# Altium project TS_24 UCM R2.PrjPcb
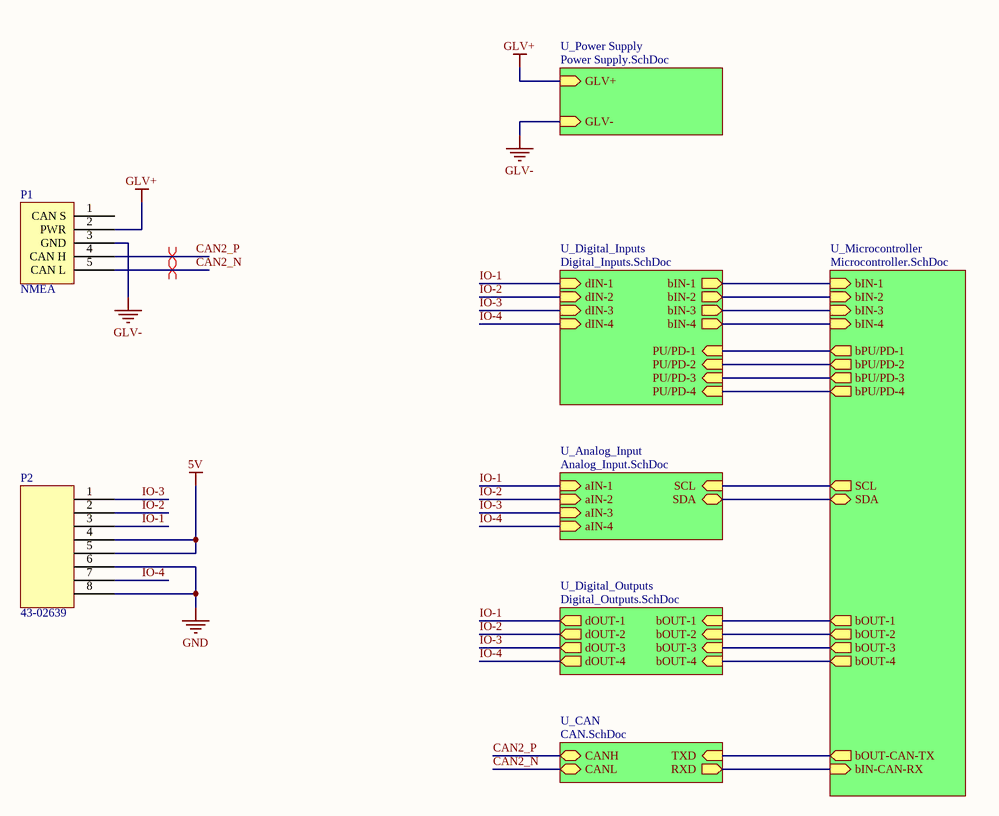
[diagram p0: Top Level.SchDoc]
7 sheets, 91 parts. Net scope: hierarchical (ports join the sheet entries above them; power ports are global).
Board file: TS_24 UCM R1.PcbDoc
Sheets:
  Top Level.SchDoc
    U_Analog_Input = Analog_Input.SchDoc
    U_Digital_Outputs = Digital_Outputs.SchDoc
    U_CAN = CAN.SchDoc
    U_Microcontroller = Microcontroller.SchDoc
    U_Power Supply = Power Supply.SchDoc
    U_Digital_Inputs = Digital_Inputs.SchDoc

## Sheet Top Level.SchDoc
size A4

### Parts
P1  NMEA  [43-01203]
P2  43-02639  [43-02639]

### Sub-sheets
U_Analog_Input = Analog_Input.SchDoc: SCL (in), SDA (bidir), aIN-1 (in), aIN-2 (in), aIN-3 (in), aIN-4 (in)
U_CAN = CAN.SchDoc: TXD (in), RXD (out), CANH (bidir), CANL (bidir)
U_Digital_Inputs = Digital_Inputs.SchDoc: dIN-1 (in), dIN-2 (in), dIN-3 (in), dIN-4 (in), bIN-4 (out), bIN-2 (out), bIN-1 (out), bIN-3 (out), PU/PD-1 (in), PU/PD-2 (in), PU/PD-3 (in), PU/PD-4 (in)
U_Digital_Outputs = Digital_Outputs.SchDoc: bOUT-1 (in), bOUT-2 (in), bOUT-3 (in), bOUT-4 (in), dOUT-1 (out), dOUT-2 (out), dOUT-3 (out), dOUT-4 (out)
U_Microcontroller = Microcontroller.SchDoc: bOUT-CAN-TX (out), bIN-CAN-RX (in), SCL (out), SDA (bidir), bOUT-1 (out), bOUT-2 (out), bOUT-3 (out), bOUT-4 (out), bIN-1 (in), bIN-2 (in), bIN-3 (in), bIN-4 (in), bPU/PD-1 (out), bPU/PD-2 (out), bPU/PD-3 (out), bPU/PD-4 (out)
U_Power Supply = Power Supply.SchDoc: GLV+ (in), GLV- (in)

### Nets
5V: P2.4 P2.5
GLV+: P1.2(PWR) ; sheet U_Power Supply/GLV+
GLV-: P1.3(GND) ; sheet U_Power Supply/GLV-
GND: P2.6 P2.8
CAN2_N: P1.5(CAN_L) ; sheet U_CAN/CANL
CAN2_P: P1.4(CAN_H) ; sheet U_CAN/CANH
IO-1: P2.3 ; sheet U_Analog_Input/aIN-1, sheet U_Digital_Outputs/dOUT-1, sheet U_Digital_Inputs/dIN-1
IO-2: P2.2 ; sheet U_Analog_Input/aIN-2, sheet U_Digital_Outputs/dOUT-2, sheet U_Digital_Inputs/dIN-2
IO-3: P2.1 ; sheet U_Analog_Input/aIN-3, sheet U_Digital_Outputs/dOUT-3, sheet U_Digital_Inputs/dIN-3
IO-4: P2.7 ; sheet U_Analog_Input/aIN-4, sheet U_Digital_Outputs/dOUT-4, sheet U_Digital_Inputs/dIN-4
SCL: sheet U_Analog_Input/SCL, sheet U_Microcontroller/SCL
SDA: sheet U_Analog_Input/SDA, sheet U_Microcontroller/SDA
NetC8_2: sheet U_Microcontroller/bIN-4, sheet U_Digital_Inputs/bIN-4
NetC9_2: sheet U_Microcontroller/bIN-2, sheet U_Digital_Inputs/bIN-2
NetC10_2: sheet U_Microcontroller/bIN-1, sheet U_Digital_Inputs/bIN-1
NetC11_2: sheet U_Microcontroller/bIN-3, sheet U_Digital_Inputs/bIN-3
NetR20_2: sheet U_Microcontroller/bPU/PD-1, sheet U_Digital_Inputs/PU/PD-1
NetR21_2: sheet U_Microcontroller/bPU/PD-2, sheet U_Digital_Inputs/PU/PD-2
NetR22_2: sheet U_Microcontroller/bPU/PD-3, sheet U_Digital_Inputs/PU/PD-3
NetR23_2: sheet U_Microcontroller/bPU/PD-4, sheet U_Digital_Inputs/PU/PD-4
NetU2_1: sheet U_Digital_Outputs/bOUT-2, sheet U_Microcontroller/bOUT-2
NetU2_3: sheet U_Digital_Outputs/bOUT-3, sheet U_Microcontroller/bOUT-3
NetU2_10: sheet U_Digital_Outputs/bOUT-4, sheet U_Microcontroller/bOUT-4
NetU2_12: sheet U_Digital_Outputs/bOUT-1, sheet U_Microcontroller/bOUT-1
NetU3_1: sheet U_CAN/TXD, sheet U_Microcontroller/bOUT-CAN-TX
NetU3_4: sheet U_CAN/RXD, sheet U_Microcontroller/bIN-CAN-RX

Not connected (* = marked no-connect by the designer): P1 1(CAN_S)

### Layout directives
differential pair: CAN2_N, CAN2_P

### Library data of the parts
P1 = 43-01203: M12 NMEA 2000 Header; Positions: 5; Angle: 90; Flange: Yes; Contact: Gold; Part Number: 43-01203; Digikey Part Number: 626-1511-ND
P2 = 43-02639: M12, 8 Pin Connector; Positions: 8; Angle: 90; Flange: Yes; Contact: Copper Alloy; Part Number: 43-02639

## Sheet Analog_Input.SchDoc
size A4
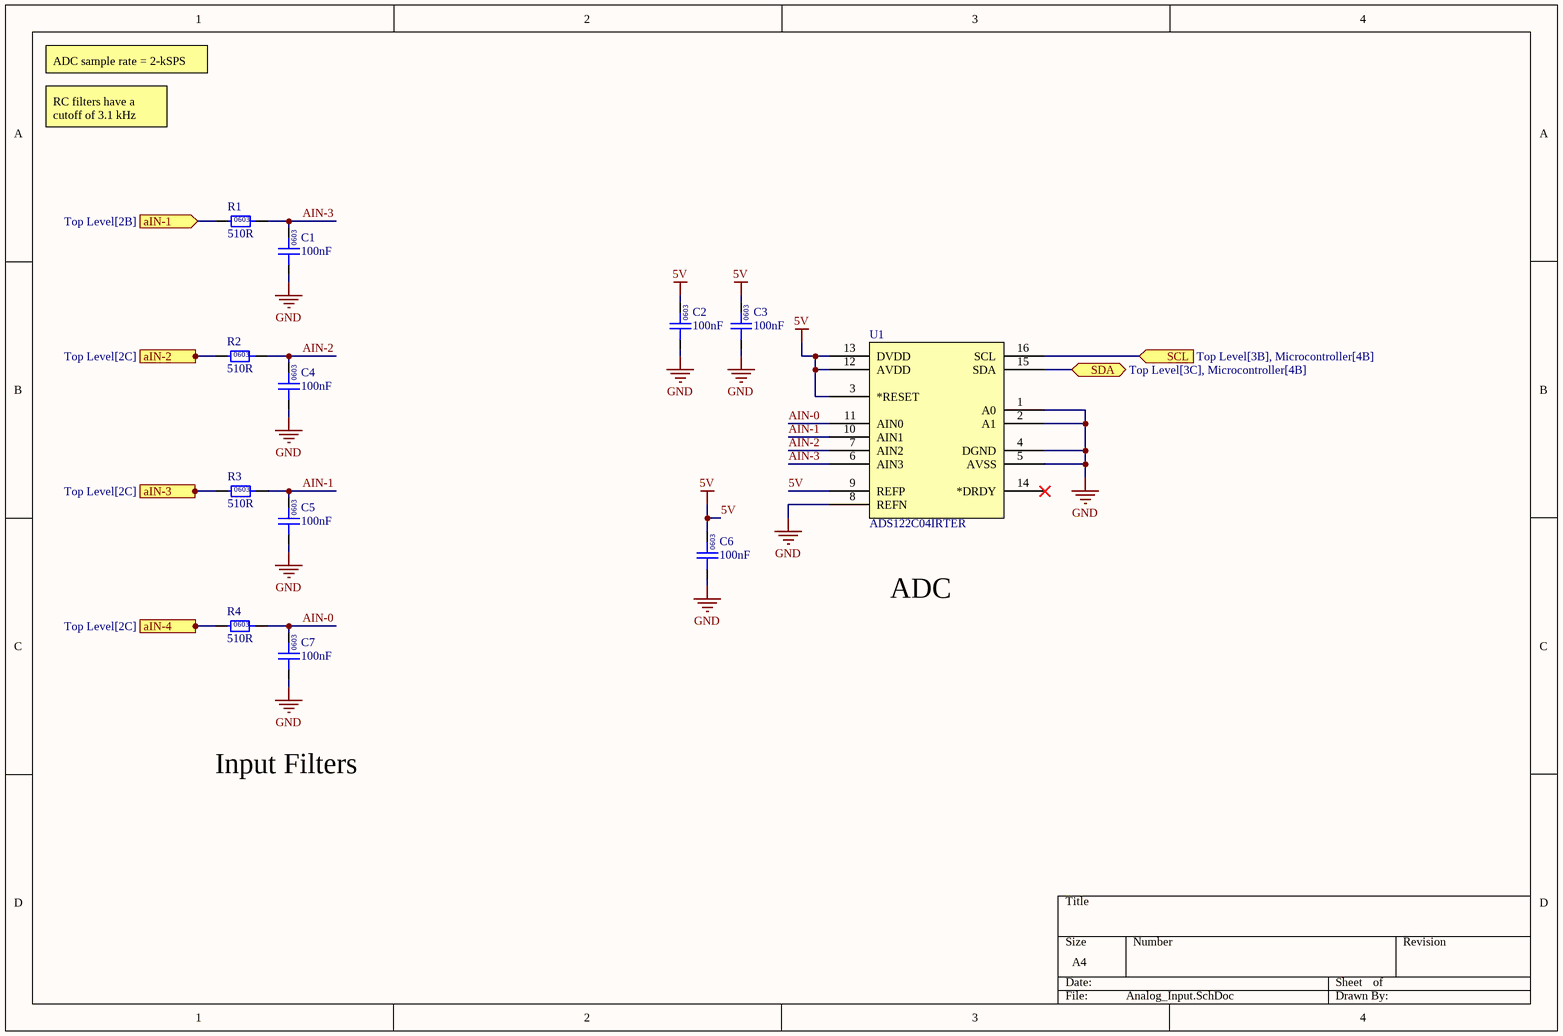
[diagram p1: Analog_Input.SchDoc]

### Parts
C1  100nF  [0603]
C2  100nF  [0603]
C3  100nF  [0603]
C4  100nF  [0603]
C5  100nF  [0603]
C6  100nF  [0603]
C7  100nF  [0603]
R1  510R  [0603]
R2  510R  [0603]
R3  510R  [0603]
R4  510R  [0603]
U1  ADS122C04IRTER  [TI 16-WQFN (3x3)]

### Ports
aIN-1 (in, see Top Level[2B]), aIN-2 (in, see Top Level[2C]), aIN-3 (in, see Top Level[2C]), aIN-4 (in, see Top Level[2C]), SCL (in, see Top Level[3B], Microcontroller[4B]), SDA (bidir, see Top Level[3C], Microcontroller[4B])

### Nets
5V: C2.2 C3.2 C6.2 U1.3(*RESET) U1.9(REFP) U1.12(AVDD) U1.13(DVDD)
GND: C1.1 C2.1 C3.1 C4.1 C5.1 C6.1 C7.1 U1.1(A0) U1.2(A1) U1.4(DGND) U1.5(AVSS) U1.8(REFN)
AIN-0: C7.2 R4.2 U1.11(AIN0)
AIN-1: C5.2 R3.2 U1.10(AIN1)
AIN-2: C4.2 R2.2 U1.7(AIN2)
AIN-3: C1.2 R1.2 U1.6(AIN3)
IO-1: R1.1 ; port aIN-1
IO-2: R2.1 ; port aIN-2
IO-3: R3.1 ; port aIN-3
IO-4: R4.1 ; port aIN-4
SCL: U1.16(SCL) ; port SCL
SDA: U1.15(SDA) ; port SDA

Not connected (* = marked no-connect by the designer): U1 14(*DRDY)*

### Notes on the sheet
- ADC sample rate = 2-kSPS
- RC filters have a cutoff of 3.1 kHz
- ADC
- Input Filters
- (in symbol GCM188L81H104KA57D) 0603
- (in symbol RC0603FR-07510RL) 0603

### Library data of the parts
C1-C7 = GCM188L81H104KA57D: Manufacturer: muRata; Rated Voltage: 50V; Tolerance: ±10%; Material: MLCC; Temperature Rating: X8L; Part Number: GCM188L81H104KA57D; Value: 100nF; Digikey Part Number: 490-6049-1-ND
R1-R4 = RC0603FR-07510RL: Manufacturer: YAGEO; Tolerance: 0.01; Rated Power: 0.1W; Part Number: RC0603FR-07510RL; Value: 510R; Material: FR-07; Digikey Part Number: 311-510HRCT-ND
U1 = ADS122C04IRTER: IC ADC 24BIT SIGMA-DELTA 16WQFN; Manufacturer: Texas Instruments; Complex IC: 1; Part Number: ADS122C04IRTER; Digikey Part Number: 296-50886-1-ND; Digikey Link: https://www.digikey.com.au/en/products/detail/texas-instruments/ADS122C04IRTER/9665929

## Sheet Digital_Outputs.SchDoc
size A4
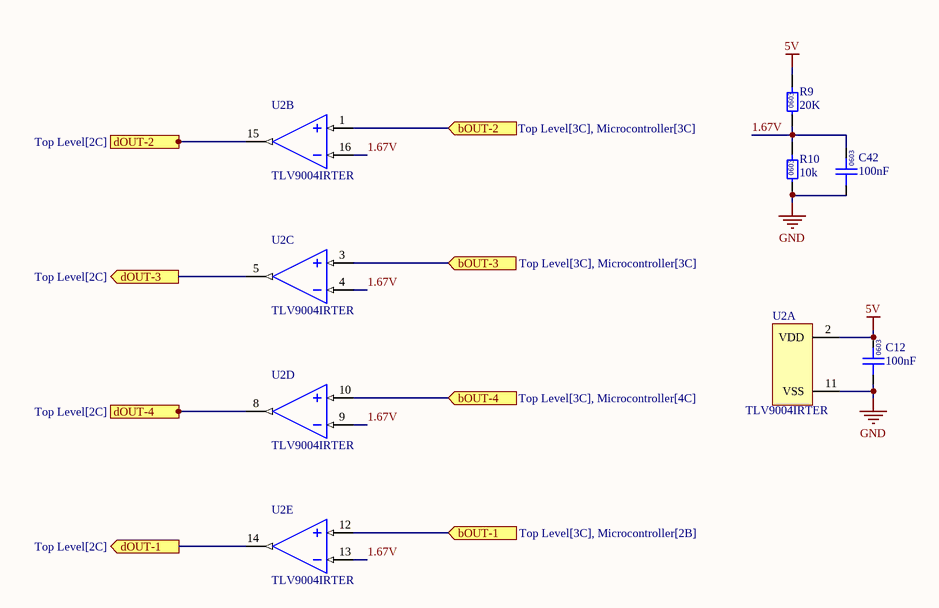
[diagram p2: Digital_Outputs.SchDoc]

### Parts
C12  100nF  [0603]
C42  100nF  [0603]
R9  20K  [0603]
R10  10k  [0603]
U2  TLV9004IRTER  [TI 16-WQFN (3x3, 1.68mm)]  (parts A,B,C,D,E of 5)

### Ports
bOUT-1 (in, see Top Level[3C], Microcontroller[2B]), bOUT-2 (in, see Top Level[3C], Microcontroller[3C]), bOUT-3 (in, see Top Level[3C], Microcontroller[3C]), bOUT-4 (in, see Top Level[3C], Microcontroller[4C]), dOUT-1 (out, see Top Level[2C]), dOUT-2 (out, see Top Level[2C]), dOUT-3 (out, see Top Level[2C]), dOUT-4 (out, see Top Level[2C])

### Nets
5V: C12.2 R9.2 U2.2(VDD)
GND: C12.1 C42.1 R10.1 U2.11(VSS)
1.67V: C42.2 R9.1 R10.2 U2.4(2IN-) U2.9(3IN-) U2.13(4IN-) U2.16(1IN+)
IO-1: U2.14(4OUT) ; port dOUT-1
IO-2: U2.15(1OUT) ; port dOUT-2
IO-3: U2.5(2OUT) ; port dOUT-3
IO-4: U2.8(3OUT) ; port dOUT-4
NetU2_1: U2.1(1IN+) ; port bOUT-2
NetU2_3: U2.3(2IN+) ; port bOUT-3
NetU2_10: U2.10(3IN+) ; port bOUT-4
NetU2_12: U2.12(4IN+) ; port bOUT-1

### Notes on the sheet
- (in symbol GCM188L81H104KA57D) 0603
- (in symbol RC0603FR-0710KL) 0603
- (in symbol RC0603FR-0720KL) 0603

### Library data of the parts
C12 C42 = GCM188L81H104KA57D: as C1 on sheet Analog_Input; Part Number: GCM188L81H104KA57D; Value: 100nF; Digikey Part Number: 490-6049-1-ND
R9 = RC0603FR-0720KL: Manufacturer: YAGEO; Tolerance: 0.01; Rated Power: 0.1W; Part Number: RC0603FR-0720KL; Value: 20K; Material: FR-07; Digikey Part Number: 311-20.0KHRCT-ND
R10 = RC0603FR-0710KL: Manufacturer: YAGEO; Tolerance: 0.01; Rated Power: 0.1W; Part Number: RC0603FR-0710KL; Value: 10k; Material: FR-07; Digikey Part Number: 311-10.0KHRCT-ND
U2 = TLV9004IRTER: IC OPAMP GP 4 CIRCUIT 16WQFN; Manufacturer: Texas Instruments; Complex IC: 0; Part Number: TLV9004IRTER; Digikey Part Number: 296-51828-1-ND; Digikey Link: https://www.digikey.com.au/en/products/detail/texas-instruments/TLV9004IRTER/9674913

## Sheet CAN.SchDoc
size A4
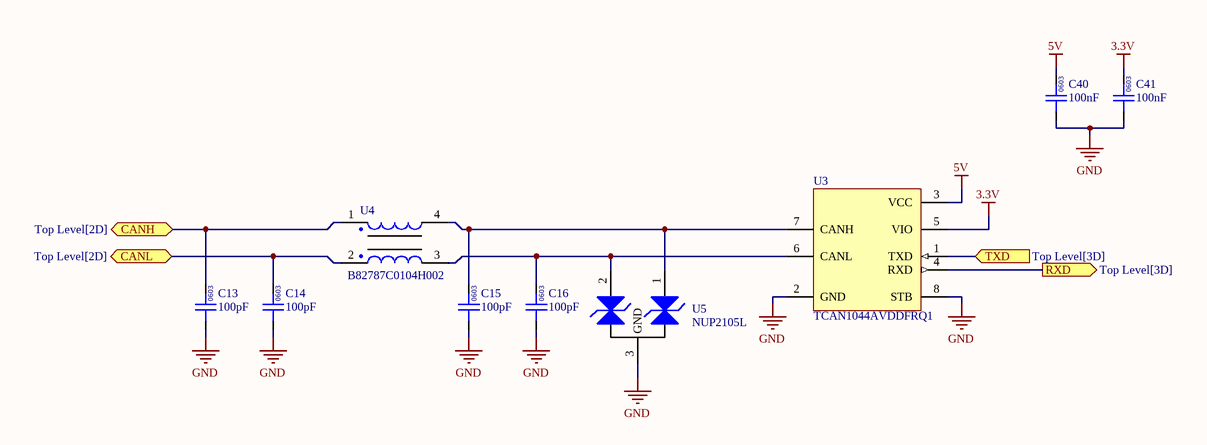
[diagram p3: CAN.SchDoc]

### Parts
C13  100pF  [0603]
C14  100pF  [0603]
C15  100pF  [0603]
C16  100pF  [0603]
C40  100nF  [0603]
C41  100nF  [0603]
U3  TCAN1044AVDDFRQ1  [TI SOT23-8]
U4  B82787C0104H002  [TDK 4-PC Pad]
U5  NUP2105L  [ON SOT-23]

### Ports
CANH (bidir, see Top Level[2D]), CANL (bidir, see Top Level[2D]), RXD (out, see Top Level[3D]), TXD (in, see Top Level[3D])

### Nets
3.3V: C41.2 U3.5(VIO)
5V: C40.2 U3.3(VCC)
GND: C13.1 C14.1 C15.1 C16.1 C40.1 C41.1 U3.2(GND) U3.8(STB) U5.3(GND)
CAN2_N: C14.2 U4.2 ; port CANL
CAN2_P: C13.2 U4.1 ; port CANH
NetC15_2: C15.2 U3.7(CANH) U4.4 U5.1(CAN_H)
NetC16_2: C16.2 U3.6(CANL) U4.3 U5.2(CAN_L)
NetU3_1: U3.1(TXD) ; port TXD
NetU3_4: U3.4(RXD) ; port RXD

### Notes on the sheet
- (in symbol GCM188L81H104KA57D) 0603
- (in symbol GRM1885C1H101JA01D) 0603

### Library data of the parts
C13-C16 = GRM1885C1H101JA01D: Manufacturer: Murata Electronics; Rated Voltage: 50V; Tolerance: ±5%; Material: MLCC; Temperature Rating: C0G, NP0; Part Number: GRM1885C1H101JA01D; Value: 100pF; Digikey Part Number: 490-1427-1-ND
C40 C41 = GCM188L81H104KA57D: as C1 on sheet Analog_Input; Part Number: GCM188L81H104KA57D; Value: 100nF; Digikey Part Number: 490-6049-1-ND
U3 = TCAN1044AVDDFRQ1: IC TRANSCEIVER HALF 1/1 TSOT23-8; Manufacturer: Texas Instruments; Complex IC: 0; Part Number: TCAN1044AVDDFRQ1; Digikey Part Number: 296-TCAN1044AVDDFRQ1CT-ND
U4 = B82787C0104H002: Manufacturer: EPCOS (TDK); Value: 100µH @ 100kHz; Impedance: 5.8 kOhms @ 10MHz; Rated Current: 150mA; Part Number: B82787C0104H002; Material: Wirewound; Digikey Part Number: 495-4598-1-ND
U5 = NUP2105L: Dual Line CAN Bus Protector; Manufacturer: ON Semiconductor; Part Number: NUP2105L; Digikey Part Number: NUP2105LT1GOSCT-ND; Digikey Link: https://www.digikey.com/product-detail/en/on-semiconductor/NUP2105LT1G/NUP2105LT1GOSCT-ND/1485001

## Sheet Microcontroller.SchDoc
size A4
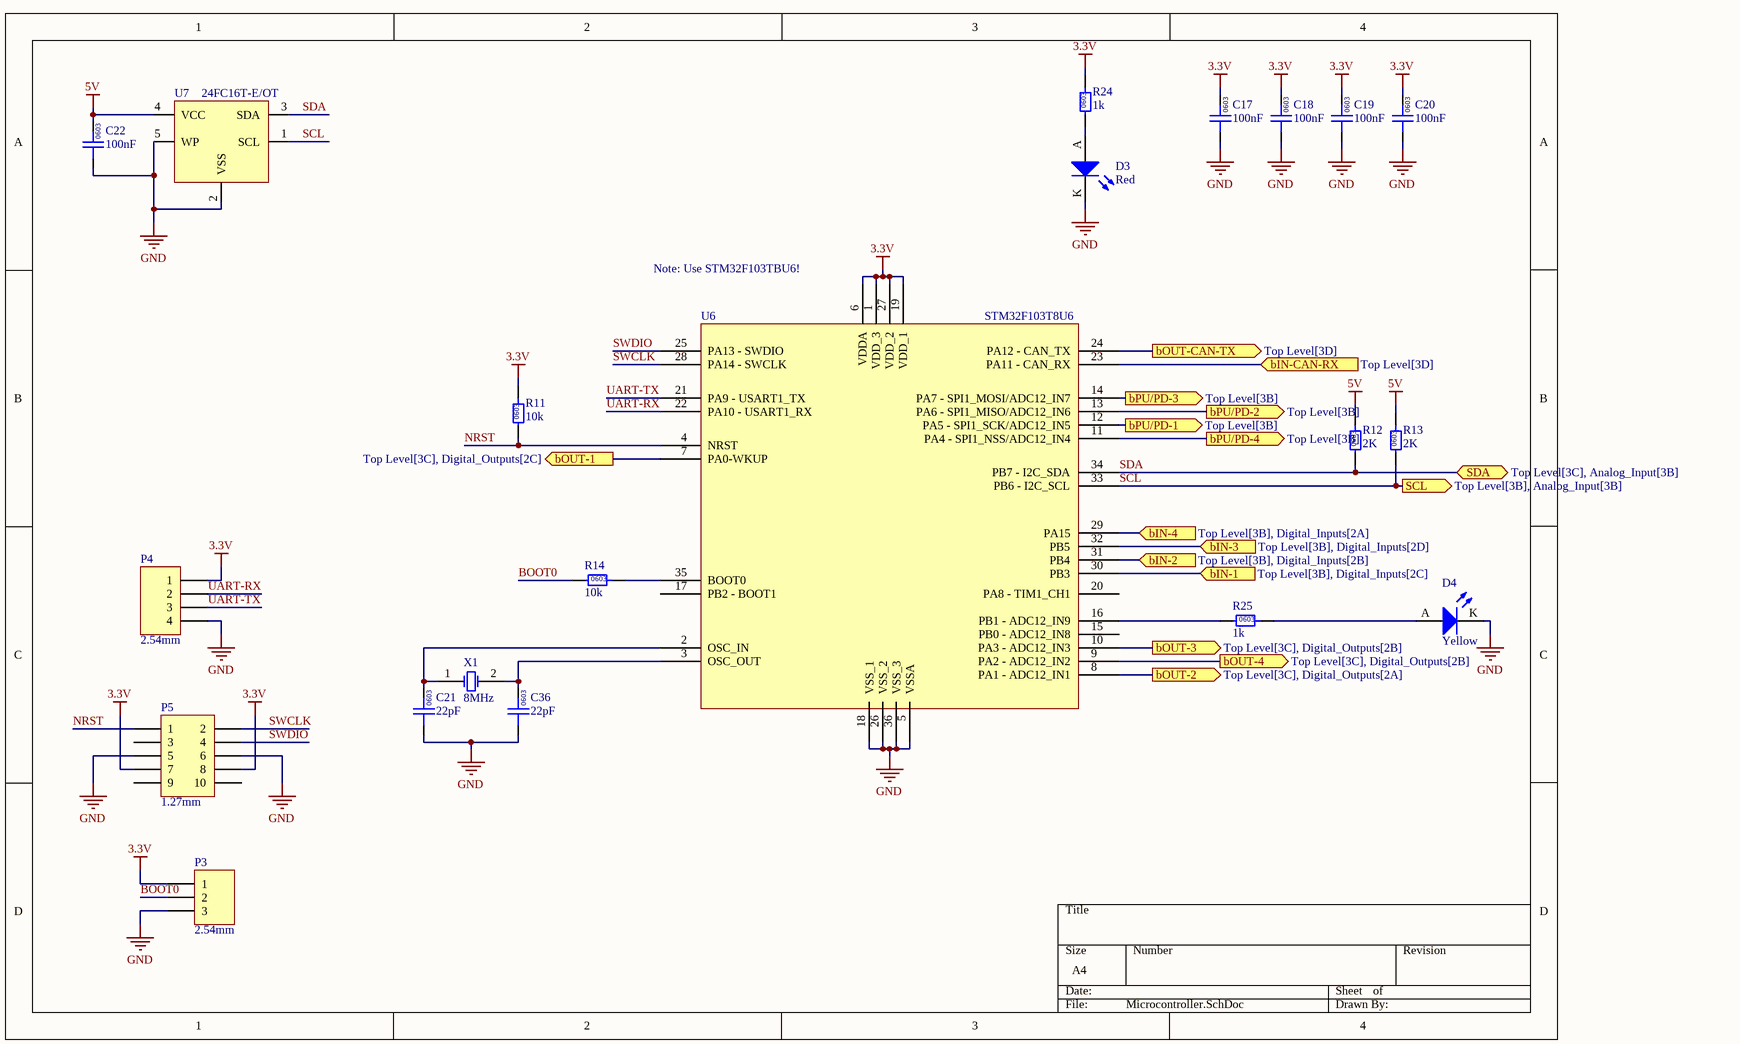
[diagram p4: Microcontroller.SchDoc]

### Parts
C17  100nF  [0603]
C18  100nF  [0603]
C19  100nF  [0603]
C20  100nF  [0603]
C21  22pF  [0603]
C22  100nF  [0603]
C36  22pF  [0603]
D3  Red  [0805 LED]
D4  Yellow  [0805 LED]
P3  2.54mm  [TH 2.54mm Header 1x3]
P4  2.54mm  [TH 2.54mm Header 1x4]
P5  1.27mm  [3221-10-0300-00]
R11  10k  [0603]
R12  2K  [0603]
R13  2K  [0603]
R14  10k  [0603]
R24  1k  [0603]
R25  1k  [0603]
U6  STM32F103T8U6  [STM_QFN-36]
U7  24FC16T-E/OT  [MCP SOT-23-5]
X1  8MHz  [ECS-80-18-30-JGN-TR]

### Ports
bIN-1 (in, see Top Level[3B], Digital_Inputs[2C]), bIN-2 (in, see Top Level[3B], Digital_Inputs[2B]), bIN-3 (in, see Top Level[3B], Digital_Inputs[2D]), bIN-4 (in, see Top Level[3B], Digital_Inputs[2A]), bIN-CAN-RX (in, see Top Level[3D]), bOUT-1 (out, see Top Level[3C], Digital_Outputs[2C]), bOUT-2 (out, see Top Level[3C], Digital_Outputs[2A]), bOUT-3 (out, see Top Level[3C], Digital_Outputs[2B]), bOUT-4 (out, see Top Level[3C], Digital_Outputs[2B]), bOUT-CAN-TX (out, see Top Level[3D]), bPU/PD-1 (out, see Top Level[3B]), bPU/PD-2 (out, see Top Level[3B]), bPU/PD-3 (out, see Top Level[3B]), bPU/PD-4 (out, see Top Level[3B]), SCL (out, see Top Level[3B], Analog_Input[3B]), SDA (bidir, see Top Level[3C], Analog_Input[3B])

### Nets
3.3V: C17.2 C18.2 C19.2 C20.2 P3.1 P4.1 P5.7 P5.8 R11.2 R24.2 U6.1(VDD_3) U6.6(VDDA) U6.19(VDD_1) U6.27(VDD_2)
5V: C22.2 R12.2 R13.2 U7.4(VCC)
GND: C17.1 C18.1 C19.1 C20.1 C21.1 C22.1 C36.1 D3.K D4.K P3.3 P4.4 P5.5 P5.6 U6.5(VSSA) U6.18(VSS_1) U6.26(VSS_2) U6.36(VSS_3) U7.2(VSS) U7.5(WP)
BOOT0: P3.2 R14.1
NRST: P5.1 R11.1 U6.4(NRST)
SCL: R13.1 U6.33(PB6_-_I2C_SCL) U7.1(SCL) ; port SCL
SDA: R12.1 U6.34(PB7_-_I2C_SDA) U7.3(SDA) ; port SDA
SWCLK: P5.2 U6.28(PA14_-_SWCLK)
SWDIO: P5.4 U6.25(PA13_-_SWDIO)
UART-RX: P4.2 U6.22(PA10_-_USART1_RX)
UART-TX: P4.3 U6.21(PA9_-_USART1_TX)
NetC8_2: U6.29(PA15) ; port bIN-4
NetC9_2: U6.31(PB4) ; port bIN-2
NetC10_2: U6.30(PB3) ; port bIN-1
NetC11_2: U6.32(PB5) ; port bIN-3
NetC21_2: C21.2 U6.2(OSC_IN) X1.1(OSC1)
NetC36_2: C36.2 U6.3(OSC_OUT) X1.2(OSC2)
NetD3_A: D3.A R24.1
NetD4_A: D4.A R25.2
NetR14_2: R14.2 U6.35(BOOT0)
NetR20_2: U6.12(PA5_-_SPI1_SCK/ADC12_IN5) ; port bPU/PD-1
NetR21_2: U6.13(PA6_-_SPI1_MISO/ADC12_IN6) ; port bPU/PD-2
NetR22_2: U6.14(PA7_-_SPI1_MOSI/ADC12_IN7) ; port bPU/PD-3
NetR23_2: U6.11(PA4_-_SPI1_NSS/ADC12_IN4) ; port bPU/PD-4
NetR25_1: R25.1 U6.16(PB1_-_ADC12_IN9)
NetU2_1: U6.8(PA1_-_ADC12_IN1) ; port bOUT-2
NetU2_3: U6.10(PA3_-_ADC12_IN3) ; port bOUT-3
NetU2_10: U6.9(PA2_-_ADC12_IN2) ; port bOUT-4
NetU2_12: U6.7(PA0-WKUP) ; port bOUT-1
NetU3_1: U6.24(PA12_-_CAN_TX) ; port bOUT-CAN-TX
NetU3_4: U6.23(PA11_-_CAN_RX) ; port bIN-CAN-RX

Not connected (* = marked no-connect by the designer): P5 3 9 10; U6 15(PB0_-_ADC12_IN8) 17(PB2_-_BOOT1_) 20(PA8_-_TIM1_CH1)

### Notes on the sheet
- (near U6) Note: Use STM32F103TBU6!
- (in symbol GCM188L81H104KA57D) 0603
- (in symbol GRM0335C1H220JA01D) 0603
- (in symbol RC0603FR-071KL) 0603
- (in symbol RC0603FR-072KL) 0603
- (in symbol RC0603FR-0710KL) 0603

### Library data of the parts
C17-C20 C22 = GCM188L81H104KA57D: as C1 on sheet Analog_Input; Part Number: GCM188L81H104KA57D; Value: 100nF; Digikey Part Number: 490-6049-1-ND
C21 C36 = GRM0335C1H220JA01D: Manufacturer: Murata Electronics; Rated Voltage: 50V; Tolerance: ±5%; Material: MLCC; Temperature Rating: C0G, NP0; Part Number: GRM0335C1H220JA01D; Value: 22pF; Digikey Part Number: 490-6123-1-ND
D3 = SML-210LTT86: Red LED Indication - Discrete 1.75V 0805 (2012 Metric); Manufacturer: ROHM Semiconductor; Part Number: SML-210LTT86; Colour: Red; Digikey Part Number: 511-1286-1-ND
D4 = SML-211YTT86: Yellow LED Indication - Discrete 1.75V 0805 (2012 Metric); Manufacturer: ROHM Semiconductor; Part Number: SML-211YTT86; Colour: Yellow; Digikey Part Number: 511-1293-1-ND
P3 = TH 2.54mm Header 1x3: Positions: 3; Angle: 0; Flange: No; Contact: NA; Part Number: TH 2.54mm Header 1x3; Pitch: 2.54mm; Row Spacing: 2.54mm
P4 = TH 2.54mm Header 1x4: Positions: 4; Angle: 0; Flange: No; Contact: NA; Part Number: TH 2.54mm Header 1x4; Pitch: 2.54mm; Row Spacing: 2.54mm
P5 = SMD 1.27mm Header 2x5 (3221-10-0300-00): Positions: 10; Angle: 0; Flange: No; Contact: NA; Part Number: SMD 1.27mm Header 2x5 (3221-10-0300-00); Pitch: 1.27mm; Row Spacing: 1.27mm
R11 R14 = RC0603FR-0710KL: as R10 on sheet Digital_Outputs; Part Number: RC0603FR-0710KL; Value: 10k; Material: FR-07; Digikey Part Number: 311-10.0KHRCT-ND
R12 R13 = RC0603FR-072KL: Manufacturer: YAGEO; Tolerance: 0.01; Rated Power: 0.1W; Part Number: RC0603FR-072KL; Value: 2K; Material: FR-07; Digikey Part Number: 311-2.00KHRCT-ND
R24 R25 = RC0603FR-071KL: Manufacturer: YAGEO; Tolerance: 0.01; Rated Power: 0.1W; Part Number: RC0603FR-071KL; Value: 1k; Material: FR-07; Digikey Part Number: 311-1.00KHRCT-ND
U6 = STM32F103T8U6: ARM® Cortex®-M3 STM32F1 Microcontroller IC 32-Bit 72MHz 64KB (64K x 8) FLASH QFN; Manufacturer: ST Microelectronics; Complex IC: 1; Part Number: STM32F103T8U6; Digikey Part Number: STM32F103T8U6; Digikey Link: https://www.digikey.com/en/products/detail/stmicroelectronics/stm32f103t8u6/1852493
U7 = 24FC16T-E/OT: IC EEPROM 16KBIT I2C SOT23-5; Manufacturer: Microchip Technology; Complex IC: 0; Part Number: 24FC16T-E/OT; Digikey Part Number: 150-24FC16T-E/OTCT-ND
X1 = ECS-80-18-30-JGN-TR: Manufacturer: ECS Inc; Load Capacitance: 18pF; ESR: 100R; Part Number: ECS-80-18-30-JGN-TR; Value: 8MHz; Digikey Part Number: XC2103CT-ND; Digikey Link: https://www.digikey.com/en/products/detail/ecs-inc/ECS-80-18-30-JGN-TR/5875530

## Sheet Power Supply.SchDoc
size A4
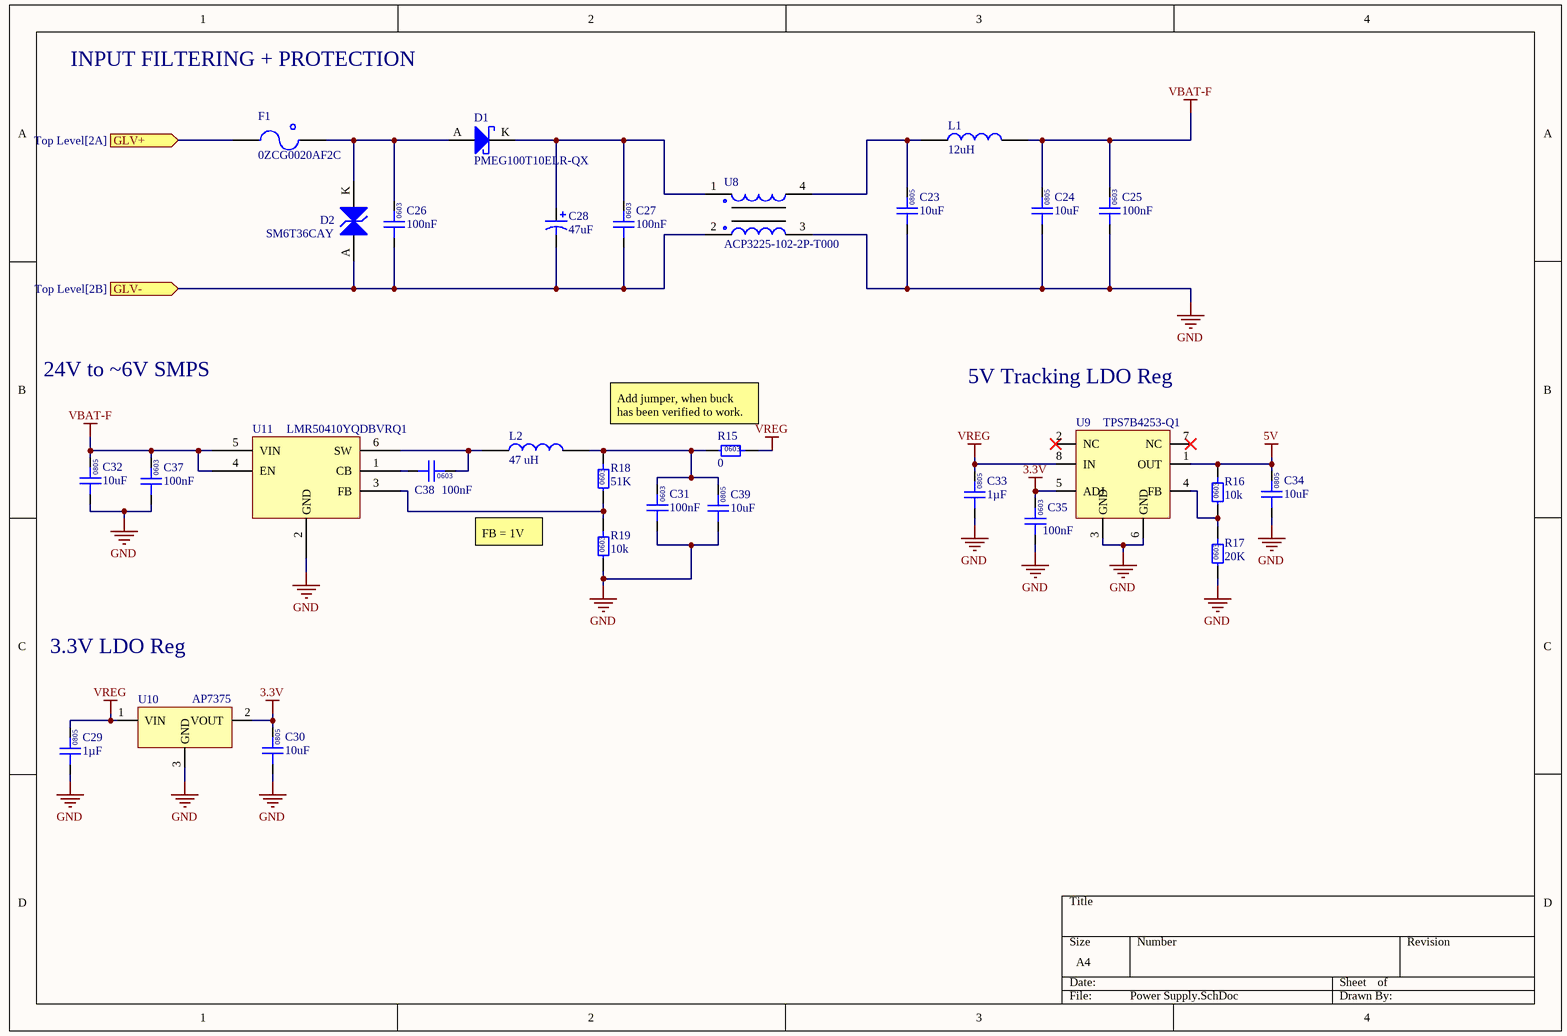
[diagram p5: Power Supply.SchDoc]

### Parts
C23  10uF  [0805]
C24  10uF  [0805]
C25  100nF  [0603]
C26  100nF  [0603]
C27  100nF  [0603]
C28  47uF  [CHEMI-CON ELCO]
C29  1µF  [0805]
C30  10uF  [0805]
C31  100nF  [0603]
C32  10uF  [0805]
C33  1µF  [0805]
C34  10uF  [0805]
C35  100nF  [0603]
C37  100nF  [0603]
C38  100nF  [0603]
C39  10uF  [0805]
D1  PMEG100T10ELR-QX  [NXP SOD123W]
D2  SM6T36CAY  [ST SMB DIODE]
F1  0ZCG0020AF2C  [1812 (PPTC FUSE)]
L1  12uH  [1812]
L2  47 uH  [SRN8040TA]
R15  0  [0603]
R16  10k  [0603]
R17  20K  [0603]
R18  51K  [0603]
R19  10k  [0603]
U8  ACP3225-102-2P-T000  [ACP3225]
U9  TPS7B4253-Q1  [TI 8-PowerSOIC]
U10  AP7375  [DI SOT-23-3]
U11  LMR50410YQDBVRQ1  [TI SOT-23-6]

### Ports
GLV+ (in, see Top Level[2A]), GLV- (in, see Top Level[2B])

### Nets
3.3V: C30.2 C35.2 U9.5(ADJ) U10.2(VOUT)
5V: C34.2 R16.2 U9.1(OUT)
GLV+: F1.1 ; port GLV+
GLV-: C26.1 C27.1 C28.1 D2.A U8.2 ; port GLV-
GND: C23.1 C24.1 C25.1 C29.1 C30.1 C31.1 C32.1 C33.1 C34.1 C35.1 C37.1 C39.1 R17.1 R19.1 U8.3 U9.3(GND) U9.6(GND) U10.3(GND) U11.2(GND)
VBAT-F: C24.2 C25.2 C32.2 C37.2 L1.1 U11.4(EN) U11.5(VIN)
VREG: C29.2 C33.2 R15.2 U9.8(IN) U10.1(VIN)
NetC23_2: C23.2 L1.2 U8.4
NetC26_2: C26.2 D1.A D2.K F1.2
NetC27_2: C27.2 C28.2 D1.K U8.1
NetC31_2: C31.2 C39.2 L2.1 R15.1 R18.2
NetC38_1: C38.1 U11.1(CB)
NetC38_2: C38.2 L2.2 U11.6(SW)
NetR16_1: R16.1 R17.2 U9.4(FB)
NetR18_1: R18.1 R19.2 U11.3(FB)

Not connected (* = marked no-connect by the designer): U9 2(NC)* 7(NC)*

### Notes on the sheet
- INPUT FILTERING + PROTECTION
- 24V to ~6V SMPS
- 5V Tracking LDO Reg
- Add jumper, when buck has been verified to work.
- FB = 1V
- 3.3V LDO Reg
- (in symbol GCM21BR71H105KA03L) 0805
- (in symbol GCM188L81H104KA57D) 0603
- (in symbol GRM21BR6YA106KE43L) 0805
- (in symbol RC0603FR-0710KL) 0603
- (in symbol RC0603FR-0720KL) 0603
- (in symbol RC0603JR-070RL) 0603
- (in symbol RC0603JR-0751KL) 0603

### Library data of the parts
C23 C24 C30 C32 C34 C39 = GRM21BR6YA106KE43L: Manufacturer: muRata; Rated Voltage: 50V; Tolerance: 10%; Material: MLCC; Temperature Rating: X5R; Part Number: GRM21BR6YA106KE43L; Value: 10uF; Digikey Part Number: 490-10514-6-ND
C25-C27 C31 C35 C37 C38 = GCM188L81H104KA57D: as C1 on sheet Analog_Input; Part Number: GCM188L81H104KA57D; Value: 100nF; Digikey Part Number: 490-6049-1-ND
C28 = HHXA350ARA470MF61G: Part Number: HHXA350ARA470MF61G
C29 C33 = GCM21BR71H105KA03L: Manufacturer: muRata; Rated Voltage: 50V; Tolerance: ±10%; Material: MLCC; Temperature Rating: X7R; Part Number: GCM21BR71H105KA03L; Value: 1µF; Digikey Part Number: 490-10675-1-ND
D1 = PMEG100T10ELR-QX: Manufacturer: Nexperia USA Inc.; Forward Voltage: 0.75 V @ 1A; Breakdown Voltage: 100 V; Rated Power: 680 mW; Part Number: PMEG100T10ELR-QX; Digikey Part Number: 1727-PMEG100T10ELR-QXCT-ND
D2 = SM6T36CAY: Manufacturer: STMicroelectronics; Forward Voltage: 30.8 V; Rated Power: 600W; Part Number: SM6T36CAY; Breakdown Voltage: 30.8 V; Digikey Part Number: 497-10804-1-ND
F1 = 0ZCG0020AF2C: PTC RESET FUSE 60V 200MA 1812; Manufacturer: Bel Fuse Inc.; Part Number: 0ZCG0020AF2C; Digikey Part Number: 507-1757-1-ND
L1 = RLS-126: Manufacturer: Recom; Tolerance: 0.2; Impedance: 230mOhm; Rated Current: 0.8 A; Material: Wirewound; Part Number: RLS-126; Value: 12uH; Digikey Part Number: 945-3429-ND
L2 = SRN8040TA-470M: Manufacturer: Bourns; Tolerance: 0.2; Impedance: 135mOhms; Rated Current: 2A; Material: Wirewound; Part Number: SRN8040TA-470M; Value: 47 uH; Digikey Part Number: SRN8040TA-470MCT-ND
R15 = RC0603JR-070RL: Manufacturer: YAGEO; Tolerance: 0.01; Rated Power: 0.1W; Part Number: RC0603JR-070RL; Value: 0; Material: FR-07; Digikey Part Number: 311-0.0GRCT-ND
R16 R19 = RC0603FR-0710KL: as R10 on sheet Digital_Outputs; Part Number: RC0603FR-0710KL; Value: 10k; Material: FR-07; Digikey Part Number: 311-10.0KHRCT-ND
R17 = RC0603FR-0720KL: as R9 on sheet Digital_Outputs; Part Number: RC0603FR-0720KL; Value: 20K; Material: FR-07; Digikey Part Number: 311-20.0KHRCT-ND
R18 = RC0603JR-0751KL: Manufacturer: YAGEO; Tolerance: 0.01; Rated Power: 0.1W; Part Number: RC0603JR-0751KL; Value: 51K; Material: FR-07; Digikey Part Number: 311-51KGRCT-ND
U8 = ACP3225-102-2P-T000: Manufacturer: TDK Corporation; Tolerance: 0.25; Impedance: 1 kOhms @ 100MHz; Rated Current: 1.5 A; Part Number: ACP3225-102-2P-T000; Material: Wirewound; Digikey Part Number: 445-8637-1-ND
U9 = TPS7B4253-Q1: IC REG LIN POS ADJ 300MA 8SO; Manufacturer: Texas Instruments; Input Voltage: 40V; Output Voltage: Variable; Part Number: TPS7B4253-Q1; Output Current: 300 mA; Digikey Part Number: 296-43781-1-ND
U10 = AP7375-33SA-7: IC REG LIN 3.3V 300MA SOT23-3; Manufacturer: Diodes Incorporated; Input Voltage: 3V - 45V; Part Number: AP7375-33SA-7; Output Voltage: 3.3 V; Output Current: 300 mA; Digikey Part Number: 31-AP7375-33SA-7CT-ND
U11 = LMR50410YQDBVRQ1: IC REG BUCK ADJ 1A SOT23-6; Manufacturer: Texas Instruments; Input Voltage: 4V to 36V; Output Voltage: Variable; Output Current: 1.0 A; Part Number: LMR50410YQDBVRQ1; Digikey Part Number: 296-LMR50410YQDBVRQ1CT-ND

## Sheet Digital_Inputs.SchDoc
size A4
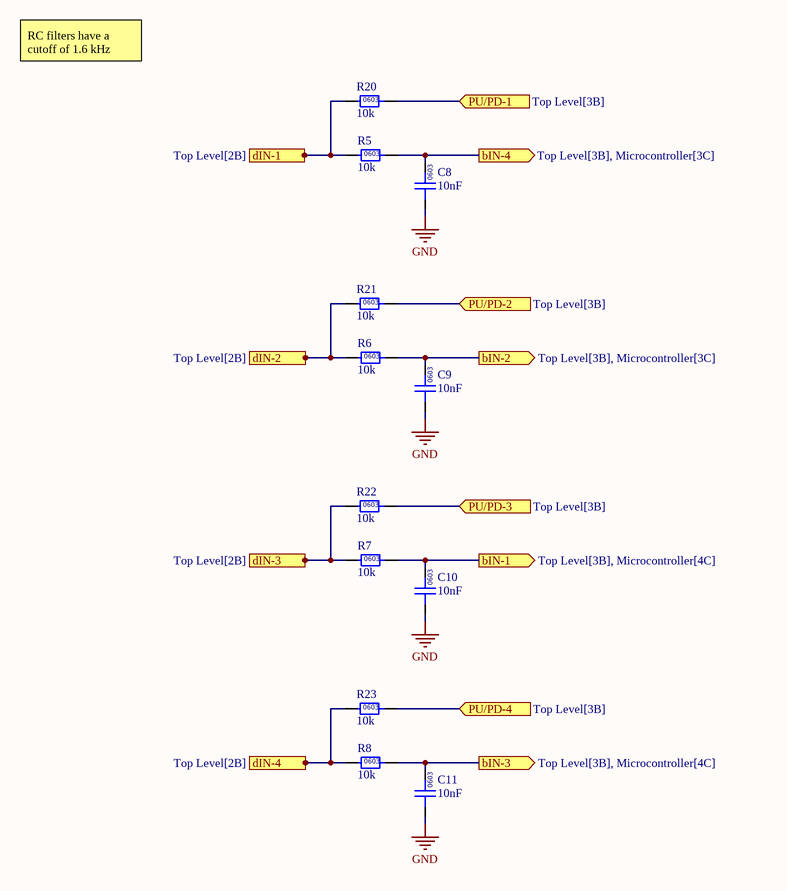
[diagram p6: Digital_Inputs.SchDoc]

### Parts
C8  10nF  [0603]
C9  10nF  [0603]
C10  10nF  [0603]
C11  10nF  [0603]
R5  10k  [0603]
R6  10k  [0603]
R7  10k  [0603]
R8  10k  [0603]
R20  10k  [0603]
R21  10k  [0603]
R22  10k  [0603]
R23  10k  [0603]

### Ports
bIN-1 (out, see Top Level[3B], Microcontroller[4C]), bIN-2 (out, see Top Level[3B], Microcontroller[3C]), bIN-3 (out, see Top Level[3B], Microcontroller[4C]), bIN-4 (out, see Top Level[3B], Microcontroller[3C]), dIN-1 (in, see Top Level[2B]), dIN-2 (in, see Top Level[2B]), dIN-3 (in, see Top Level[2B]), dIN-4 (in, see Top Level[2B]), PU/PD-1 (in, see Top Level[3B]), PU/PD-2 (in, see Top Level[3B]), PU/PD-3 (in, see Top Level[3B]), PU/PD-4 (in, see Top Level[3B])

### Nets
GND: C8.1 C9.1 C10.1 C11.1
IO-1: R5.1 R20.1 ; port dIN-1
IO-2: R6.1 R21.1 ; port dIN-2
IO-3: R7.1 R22.1 ; port dIN-3
IO-4: R8.1 R23.1 ; port dIN-4
NetC8_2: C8.2 R5.2 ; port bIN-4
NetC9_2: C9.2 R6.2 ; port bIN-2
NetC10_2: C10.2 R7.2 ; port bIN-1
NetC11_2: C11.2 R8.2 ; port bIN-3
NetR20_2: R20.2 ; port PU/PD-1
NetR21_2: R21.2 ; port PU/PD-2
NetR22_2: R22.2 ; port PU/PD-3
NetR23_2: R23.2 ; port PU/PD-4

### Notes on the sheet
- RC filters have a cutoff of 1.6 kHz
- (in symbol GCM188L81H103KA03D) 0603
- (in symbol RC0603FR-0710KL) 0603

### Library data of the parts
C8-C11 = GCM188L81H103KA03D: Manufacturer: muRata; Rated Voltage: 50V; Tolerance: ±10%; Material: MLCC; Temperature Rating: X8L; Part Number: GCM188L81H103KA03D; Value: 10nF; Digikey Part Number: 490-GCM188L81H103KA03DCT-ND
R5-R8 R20-R23 = RC0603FR-0710KL: as R10 on sheet Digital_Outputs; Part Number: RC0603FR-0710KL; Value: 10k; Material: FR-07; Digikey Part Number: 311-10.0KHRCT-ND

## Nets that join several sheets
3.3V: CAN (C41.2 U3.5), Microcontroller (14 pins), Power Supply (C30.2 C35.2 U9.5 U10.2)
5V: Top Level (P2.4 P2.5), Analog_Input (7 pins), Digital_Outputs (C12.2 R9.2 U2.2), CAN (C40.2 U3.3), Microcontroller (C22.2 R12.2 R13.2 U7.4), Power Supply (C34.2 R16.2 U9.1)
GLV+: Top Level (P1.2), Power Supply (F1.1)
GLV-: Top Level (P1.3), Power Supply (5 pins)
GND: Top Level (P2.6 P2.8), Analog_Input (12 pins), Digital_Outputs (C12.1 C42.1 R10.1 U2.11), CAN (9 pins), Microcontroller (19 pins), Power Supply (19 pins), Digital_Inputs (C8.1 C9.1 C10.1 C11.1)
CAN2_N: Top Level (P1.5), CAN (C14.2 U4.2)
CAN2_P: Top Level (P1.4), CAN (C13.2 U4.1)
IO-1: Top Level (P2.3), Analog_Input (R1.1), Digital_Outputs (U2.14), Digital_Inputs (R5.1 R20.1)
IO-2: Top Level (P2.2), Analog_Input (R2.1), Digital_Outputs (U2.15), Digital_Inputs (R6.1 R21.1)
IO-3: Top Level (P2.1), Analog_Input (R3.1), Digital_Outputs (U2.5), Digital_Inputs (R7.1 R22.1)
IO-4: Top Level (P2.7), Analog_Input (R4.1), Digital_Outputs (U2.8), Digital_Inputs (R8.1 R23.1)
NetC8_2: Microcontroller (U6.29), Digital_Inputs (C8.2 R5.2)
NetC9_2: Microcontroller (U6.31), Digital_Inputs (C9.2 R6.2)
NetC10_2: Microcontroller (U6.30), Digital_Inputs (C10.2 R7.2)
NetC11_2: Microcontroller (U6.32), Digital_Inputs (C11.2 R8.2)
NetR20_2: Microcontroller (U6.12), Digital_Inputs (R20.2)
NetR21_2: Microcontroller (U6.13), Digital_Inputs (R21.2)
NetR22_2: Microcontroller (U6.14), Digital_Inputs (R22.2)
NetR23_2: Microcontroller (U6.11), Digital_Inputs (R23.2)
NetU2_1: Digital_Outputs (U2.1), Microcontroller (U6.8)
NetU2_3: Digital_Outputs (U2.3), Microcontroller (U6.10)
NetU2_10: Digital_Outputs (U2.10), Microcontroller (U6.9)
NetU2_12: Digital_Outputs (U2.12), Microcontroller (U6.7)
NetU3_1: CAN (U3.1), Microcontroller (U6.24)
NetU3_4: CAN (U3.4), Microcontroller (U6.23)
SCL: Analog_Input (U1.16), Microcontroller (R13.1 U6.33 U7.1)
SDA: Analog_Input (U1.15), Microcontroller (R12.1 U6.34 U7.3)